# EAGLE design M207C (EAGLE 6.6.0)
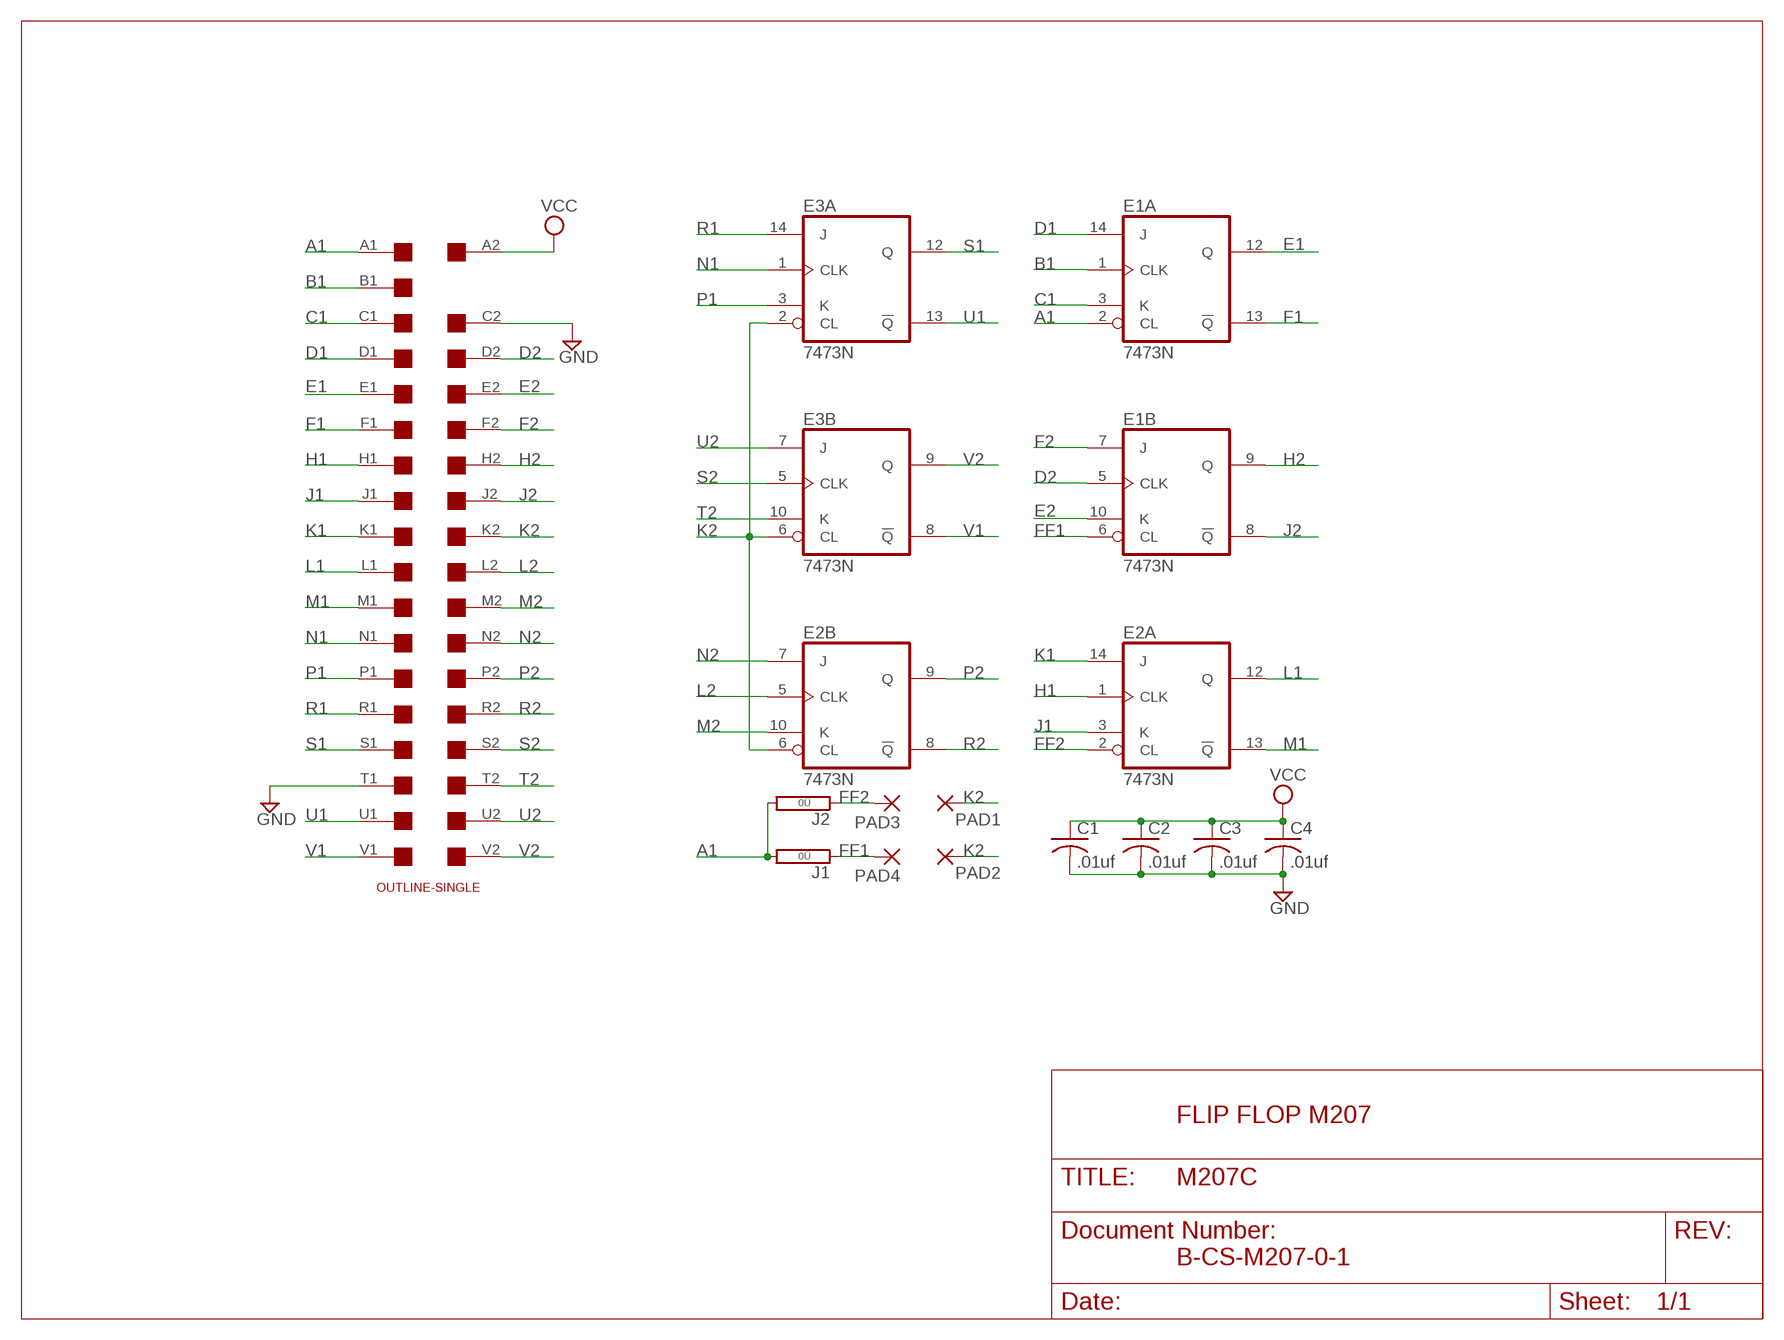
[diagram p0: schematic, sheet 1]

## Parts
C1  .01uf  C-US050-025X075  [C050-025X075]
C2  .01uf  C-US050-025X075  [C050-025X075]
C3  .01uf  C-US050-025X075  [C050-025X075]
C4  .01uf  C-US050-025X075  [C050-025X075]
E1  7473N  74LS73N  [DIL14]
E2  7473N  74LS73N  [DIL14]
E3  7473N  74LS73N  [DIL14]
J1  0R  [0R/10]
J2  0R  [0R/10]
PAD1  1,6/0,8  [1,6/0,8]
PAD2  1,6/0,8  [1,6/0,8]
PAD3  1,6/0,8  [1,6/0,8]
PAD4  1,6/0,8  [1,6/0,8]
U$1  SINGLE  [EDGE-CON2]
U$4  OUTLINE-SINGLE  [SINGLE]

## Nets
A1: E1.2(A:CL) J1.2 J2.2 U$1.A1
B1: E1.1(A:CLK) U$1.B1
C1: E1.3(A:K) U$1.C1
D1: E1.14(A:J) U$1.D1
D2: E1.5(B:CLK) U$1.D2
E1: E1.12(A:Q) U$1.E1
E2: E1.10(B:K) U$1.E2
F1: E1.13(A:!Q) U$1.F1
F2: E1.7(B:J) U$1.F2
FF1: E1.6(B:CL) J1.1 PAD4.1(P)
FF2: E2.2(A:CL) J2.1 PAD3.1(P)
GND [Supply]: C1.2 C2.2 C3.2 C4.2 U$1.C2 U$1.T1
H1: E2.1(A:CLK) U$1.H1
H2: E1.9(B:Q) U$1.H2
J1: E2.3(A:K) U$1.J1
J2: E1.8(B:!Q) U$1.J2
K1: E2.14(A:J) U$1.K1
K2: E2.6(B:CL) E3.2(A:CL) E3.6(B:CL) PAD1.1(P) PAD2.1(P) U$1.K2
L1: E2.12(A:Q) U$1.L1
L2: E2.5(B:CLK) U$1.L2
M1: E2.13(A:!Q) U$1.M1
M2: E2.10(B:K) U$1.M2
N1: E3.1(A:CLK) U$1.N1
N2: E2.7(B:J) U$1.N2
P1: E3.3(A:K) U$1.P1
P2: E2.9(B:Q) U$1.P2
R1: E3.14(A:J) U$1.R1
R2: E2.8(B:!Q) U$1.R2
S1: E3.12(A:Q) U$1.S1
S2: E3.5(B:CLK) U$1.S2
T2: E3.10(B:K) U$1.T2
U1: E3.13(A:!Q) U$1.U1
U2: E3.7(B:J) U$1.U2
V1: E3.8(B:!Q) U$1.V1
V2: E3.9(B:Q) U$1.V2
VCC [Supply]: C1.1 C2.1 C3.1 C4.1 U$1.A2
Unconnected: U$1.B2

## Notes on the sheet
- FLIP FLOP M207
- B-CS-M207-0-1

## Power pins joined to a net without a drawn wire
GND: E1.11(P:GND) E2.11(P:GND) E3.11(P:GND)
VCC: E1.4(P:VCC) E2.4(P:VCC) E3.4(P:VCC)

## Library data of the parts
C1-C4 = rcl:C-US: CAPACITOR, American symbol
E1-E3 = 74xx-us:74*73: Dual J-K FLIP FLOP, clear
J1 J2 = jumper:0R: Bridge 0R 10mm
PAD1-PAD4 = wirepad:1,6/0,8: THROUGH-HOLE PAD
U$1 = dec-con:SINGLE: Single-Height DEC board
U$4 = dec-con:OUTLINE-*: Board outlines for DEC boards.

## Net classes
1 Supply: width 0.813 mm

## Board
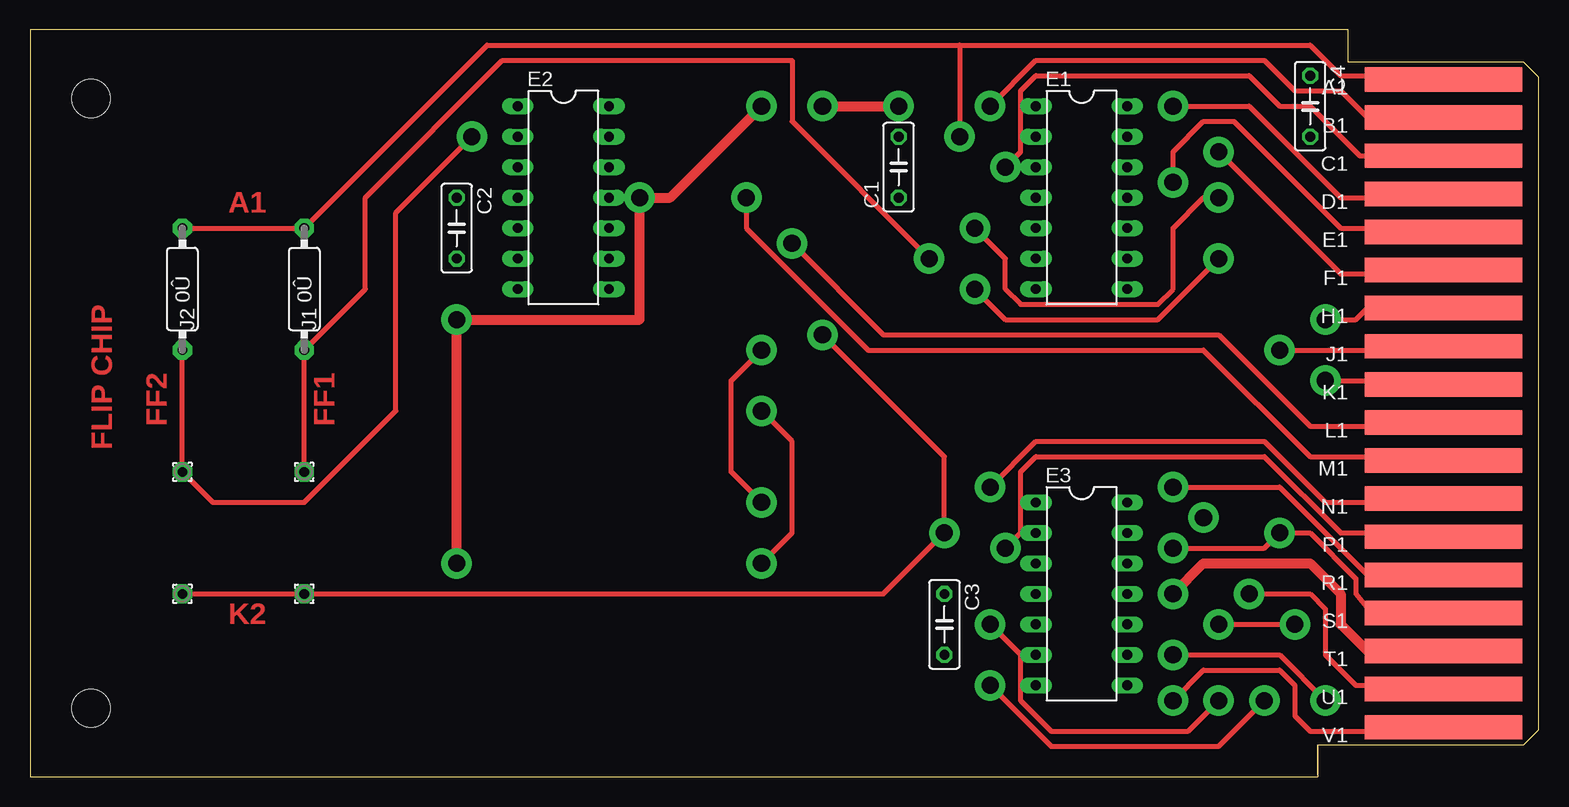
[diagram p1: board, top side]
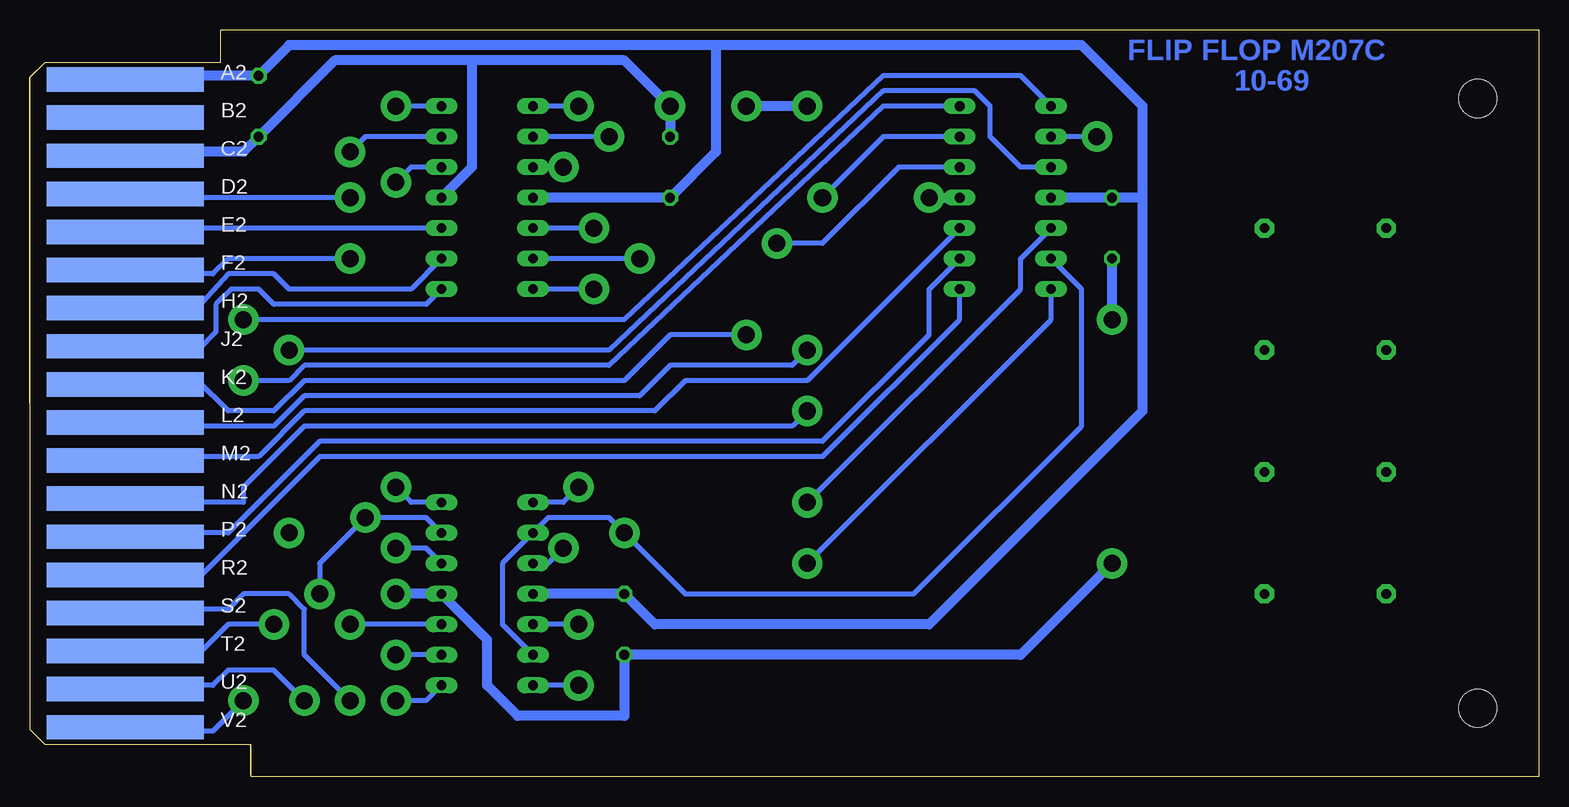
[diagram p2: board, bottom side, seen from below]

Size 125.73 x 62.23 mm. Coordinates in mm from the lower left corner, seen from the top.
Copper layers (1+16): Top 0.035mm / dielectric 1.5mm / Bottom 0.035mm
Design rules "16mils": minimum track width 16mil, minimum drill 32mil, track to track 15mil, track to pad 10mil, pad to pad 10mil, via to via 10mil, smd to smd 10mil, copper to edge 13mil, drill to drill 10mil, minimum pad ring 10mil, minimum via ring 8mil, stop-mask expansion 0mil, vias tented up to drill 0mil, thermal gap 10mil

### Footprints (pad centres in the part's own frame; a part is rotated, then mirrored left to right if it is on the bottom)
C050-025X075 = drill 0.813 octagon: 1 -2.54,0; 2 2.54,0
DIL14 = drill 0.813 long: 1 -7.62,-3.81; 2 -5.08,-3.81; 3 -2.54,-3.81; 4 0,-3.81; 5 2.54,-3.81; 6 5.08,-3.81; 7 7.62,-3.81; 8 7.62,3.81; 9 5.08,3.81; 10 2.54,3.81; 11 0,3.81; 12 -2.54,3.81; 13 -5.08,3.81; 14 -7.62,3.81
0R/10 = drill 0.813 pad 1.6 octagon: 1 -5.08,0; 2 5.08,0
1,6/0,8 = drill 0.813 pad 1.6 octagon: 1 0,0
EDGE-CON2 = smd 13.106 x 2.032: A1 7.938,4.128; B1 7.938,7.303; C1 7.938,10.477; D1 7.938,13.652; E1 7.938,16.828; F1 7.938,20.003; H1 7.938,23.177; J1 7.938,26.352; K1 7.938,29.527; L1 7.938,32.703; M1 7.938,35.877; N1 7.938,39.053; P1 7.938,42.227; R1 7.938,45.403; S1 7.938,48.578; T1 7.938,51.752; U1 7.938,54.928; V1 7.938,58.102 | smd 13.106 x 2.032 bottom: A2 7.938,4.128; B2 7.938,7.303; C2 7.938,10.477; D2 7.938,13.652; E2 7.938,16.828; F2 7.938,20.003; H2 7.938,23.177; J2 7.938,26.352; K2 7.938,29.527; L2 7.938,32.703; M2 7.938,35.877; N2 7.938,39.053; P2 7.938,42.227; R2 7.938,45.403; S2 7.938,48.578; T2 7.938,51.752; U2 7.938,54.928; V2 7.938,58.102
SINGLE = hole 3.175: 120.65,56.515; 120.65,5.715

### Placement (x,y rotation side)
C1  72.39,50.8 90 top
C2  35.56,45.72 270 top
C3  76.2,12.7 270 top
C4  106.68,55.88 270 top
E1  87.63,48.26 270 top
E2  44.45,48.26 270 top
E3  87.63,15.24 270 top
J1  22.86,40.64 90 top
J2  12.7,40.64 90 top
PAD1  12.7,15.24 270 top
PAD2  22.86,15.24 270 top
PAD3  12.7,25.4 270 top
PAD4  22.86,25.4 270 top
U$1  125.73,62.23 180 top
U$4  125.73,62.23 180 top

### Tracks (layer width: path | path; a pad name or v marks a point on that pad's centre or on a via)
A1  (via drill 1.42 pad 2.54)
  Top 0.406: J1.2 J2.2 J1.2 | U$1.A1 112.16,58.02 111.76,58.42 109.22,58.42 106.68,60.96 77.47,60.96 | 77.47,60.96 v77.47,53.34 | J1.2 38.1,60.96 77.47,60.96
  Bottom 0.406: v77.47,53.34 E1.2
B1  (via drill 1.42 pad 2.54)
  Top 0.406: U$1.B1 112.05,54.9 111.76,54.61 109.22,57.15 105.41,57.15 102.87,59.69 83.82,59.69 v80.01,55.88
  Bottom 0.406: v80.01,55.88 E1.1
C1  (via drill 1.42 pad 2.54)
  Top 0.406: U$1.C1 110.82,51.74 106.68,55.88 104.14,55.88 101.6,58.42 83.82,58.42 82.55,57.15 82.55,52.07 v81.28,50.8
  Bottom 0.406: v81.28,50.8 E1.3
D1  (via drill 1.42 pad 2.54)
  Top 0.406: U$1.D1 112.06,48.56 111.76,48.26 109.22,48.26 101.6,55.88 v95.25,55.88
  Bottom 0.406: E1.14 v95.25,55.88
D2  (via drill 1.42 pad 2.54)
  Top 0.406: v99.06,48.26 97.79,48.26 95.25,45.72 95.25,40.64 93.98,39.37 82.55,39.37 81.28,40.64 81.28,43.18 v78.74,45.72
  Bottom 0.406: v78.74,45.72 E1.5 | U$1.D2 112.06,48.56 111.76,48.26 v99.06,48.26
E1  (via drill 1.42 pad 2.54)
  Top 0.406: v95.25,49.53 95.25,52.07 97.79,54.61 100.33,54.61 109.22,45.72 111.76,45.72 112.09,45.39 U$1.E1
  Bottom 0.406: E1.12 93.98,50.8 v95.25,49.53
E2
  Bottom 0.406: U$1.E2 112.09,45.39 111.76,45.72 E1.10
F1  (via drill 1.42 pad 2.54)
  Top 0.406: v99.06,52.07 109.22,41.91 111.76,41.91 112.04,42.19 U$1.F1
  Bottom 0.406: E1.13 97.79,53.34 v99.06,52.07
F2  (via drill 1.42 pad 2.54)
  Top 0.406: v99.06,43.18 93.98,38.1 81.28,38.1 v78.74,40.64
  Bottom 0.406: v78.74,40.64 E1.7 | U$1.F2 112.04,42.19 111.76,41.91 110.49,41.91 109.22,43.18 v99.06,43.18
FF1  (via drill 1.42 pad 2.54)
  Top 0.406: PAD4.1 J1.1 27.94,40.64 27.94,48.26 39.37,59.69 63.5,59.69 63.5,54.61 v74.93,43.18
  Bottom 0.406: v74.93,43.18 E1.6
FF2  (via drill 1.42 pad 2.54)
  Top 0.406: J2.1 PAD3.1 15.24,22.86 22.86,22.86 30.48,30.48 30.48,46.99 v36.83,53.34
  Bottom 0.406: v36.83,53.34 E2.2
GND  (via drill 1.42 pad 2.54)
  Top 0.813: U$1.T1 112.09,10.49 111.76,10.16 109.22,12.7 109.22,15.24 106.68,17.78 97.79,17.78 v95.25,15.24 | v66.04,55.88 v72.39,55.88 | v60.96,55.88 53.34,48.26 v50.8,48.26 50.8,38.1 v35.56,38.1 v35.56,17.78
  Bottom 0.813: v95.25,15.24 E3.11 87.63,11.43 87.63,7.62 85.09,5.08 76.2,5.08 C3.2 43.18,10.16 v35.56,17.78 | C1.2 v72.39,55.88 76.2,59.69 88.9,59.69 | v60.96,55.88 v66.04,55.88 | v50.8,48.26 E2.11 | U$1.C2 112.09,51.74 111.76,52.07 107.95,52.07 C4.2 100.33,59.69 88.9,59.69 | v35.56,38.1 C2.2 | E1.11 88.9,50.8 88.9,59.69
H1  (via drill 1.42 pad 2.54)
  Top 0.406: U$1.H1 117.76,39.37 111.76,39.37 110.49,38.1 v107.95,38.1
  Bottom 0.406: E2.1 43.18,58.42 54.61,58.42 76.2,38.1 v107.95,38.1
H2
  Bottom 0.406: U$1.H2 111.84,39.04 109.22,41.91 105.41,41.91 104.14,40.64 93.98,40.64 E1.9
J1  (via drill 1.42 pad 2.54)
  Top 0.406: U$1.J1 117.76,35.56 v104.14,35.56
  Bottom 0.406: E2.3 43.18,50.8 45.72,53.34 45.72,55.88 46.99,57.15 54.61,57.15 77.47,35.56 v104.14,35.56
J2
  Bottom 0.406: U$1.J2 112.09,35.89 111.76,35.56 110.24,37.08 110.24,39.37 108.97,40.64 106.68,40.64 105.41,39.37 92.71,39.37 E1.8
K1  (via drill 1.42 pad 2.54)
  Top 0.406: U$1.K1 117.78,33.02 v107.95,33.02
  Bottom 0.406: E2.14 54.61,55.88 77.47,34.29 102.87,34.29 104.14,33.02 v107.95,33.02
K2  (via drill 1.42 pad 2.54)
  Top 0.406: PAD1.1 PAD2.1 71.12,15.24 v76.2,20.32 76.2,26.67 v66.04,36.83
  Bottom 0.406: E3.6 86.36,12.7 86.36,17.78 E3.2 82.55,21.59 77.47,21.59 v76.2,20.32 71.12,15.24 52.07,15.24 38.1,29.21 38.1,40.64 E2.6 | U$1.K2 112.06,32.72 111.76,33.02 109.22,30.48 105.41,30.48 102.87,33.02 76.2,33.02 72.39,36.83 v66.04,36.83
L1  (via drill 1.42 pad 2.54)
  Top 0.406: U$1.L1 112.09,29.54 111.76,29.21 106.68,29.21 99.06,36.83 71.12,36.83 v63.5,44.45
  Bottom 0.406: E2.12 53.34,50.8 59.69,44.45 v63.5,44.45
L2  (via drill 1.42 pad 2.54)
  Top 0.406: v60.96,22.86 58.42,25.4 58.42,33.02 v60.96,35.56
  Bottom 0.406: E2.5 43.18,43.18 43.18,40.64 v60.96,22.86 | U$1.L2 112.09,29.54 111.76,29.21 105.41,29.21 102.87,31.75 74.93,31.75 72.39,34.29 62.23,34.29 v60.96,35.56
M1  (via drill 1.42 pad 2.54)
  Top 0.406: U$1.M1 112.09,26.34 111.76,26.67 106.68,26.67 97.79,35.56 69.85,35.56 59.69,45.72 v59.69,48.26
  Bottom 0.406: E2.13 54.61,53.34 v59.69,48.26
M2
  Bottom 0.406: E2.10 60.96,33.02 71.12,33.02 73.66,30.48 102.87,30.48 106.68,26.67 111.76,26.67 112.09,26.34 U$1.M2
N1  (via drill 1.42 pad 2.54)
  Top 0.406: U$1.N1 112.09,23.19 111.76,22.86 107.95,22.86 102.87,27.94 83.82,27.94 v80.01,24.13
  Bottom 0.406: E3.1 81.28,22.86 v80.01,24.13
N2  (via drill 1.42 pad 2.54)
  Top 0.406: v60.96,17.78 63.5,20.32 63.5,27.94 v60.96,30.48
  Bottom 0.406: E2.7 40.64,38.1 v60.96,17.78 | U$1.N2 112.09,23.19 111.76,22.86 107.95,22.86 107.95,24.13 102.87,29.21 62.23,29.21 v60.96,30.48
P1  (via drill 1.42 pad 2.54)
  Top 0.406: U$1.P1 112.09,19.99 111.76,20.32 109.22,20.32 102.87,26.67 83.82,26.67 82.55,25.4 82.55,20.32 v81.28,19.05
  Bottom 0.406: E3.3 82.55,17.78 v81.28,19.05
P2
  Bottom 0.406: E2.9 50.8,40.64 50.8,36.83 59.69,27.94 101.6,27.94 109.22,20.32 111.76,20.32 U$1.P2
R1  (via drill 1.42 pad 2.54)
  Top 0.406: U$1.R1 117.76,16.51 111.76,16.51 104.14,24.13 v95.25,24.13
  Bottom 0.406: v95.25,24.13 93.98,22.86 E3.14
R2
  Bottom 0.406: E2.8 48.26,38.1 59.69,26.67 101.6,26.67 111.76,16.51 112.09,16.84 U$1.R2
S1  (via drill 1.42 pad 2.54)
  Top 0.406: v95.25,19.05 102.87,19.05 v104.14,20.32 106.68,20.32 110.49,16.51 110.49,15.24 111.51,13.97 117.78,13.97 U$1.S1
  Bottom 0.406: E3.12 92.71,19.05 v95.25,19.05
S2  (via drill 1.42 pad 2.54)
  Top 0.406: v99.06,6.35 96.52,3.81 85.09,3.81 82.55,6.35 82.55,10.16 v80.01,12.7
  Bottom 0.406: U$1.S2 117.78,13.97 109.22,13.97 107.95,15.24 104.14,15.24 102.87,13.97 102.87,10.16 v99.06,6.35 | v80.01,12.7 E3.5
T2  (via drill 1.42 pad 2.54)
  Top 0.406: v99.06,12.7 v105.41,12.7
  Bottom 0.406: U$1.T2 117.76,10.16 111.76,10.16 109.22,12.7 v105.41,12.7 | E3.10 v99.06,12.7
U1  (via drill 1.42 pad 2.54)
  Top 0.406: U$1.U1 117.73,7.62 110.49,7.62 107.95,10.16 107.95,13.97 106.68,15.24 v101.6,15.24
  Bottom 0.406: E3.13 92.71,21.59 v97.79,21.59 101.6,17.78 v101.6,15.24
U2  (via drill 1.42 pad 2.54)
  Top 0.406: v102.87,6.35 99.06,2.54 85.09,2.54 v80.01,7.62
  Bottom 0.406: U$1.U2 117.73,7.62 110.49,7.62 109.22,8.89 105.41,8.89 v102.87,6.35 | v80.01,7.62 E3.7
V1  (via drill 1.42 pad 2.54)
  Top 0.406: U$1.V1 112.15,4.2 111.76,3.81 106.68,3.81 105.41,5.08 105.41,7.62 104.14,8.89 97.79,8.89 v95.25,6.35
  Bottom 0.406: v95.25,6.35 92.71,6.35 E3.8
V2  (via drill 1.42 pad 2.54)
  Top 0.406: v95.25,10.16 104.14,10.16 v107.95,6.35
  Bottom 0.406: U$1.V2 112.15,4.2 111.76,3.81 110.49,3.81 v107.95,6.35 | E3.9 v95.25,10.16
VCC
  Bottom 0.813: E3.4 C3.1 73.66,12.7 50.8,12.7 33.02,30.48 33.02,48.26 | E1.4 C1.1 68.58,52.07 68.58,60.96 | U$1.A2 112.16,58.02 111.76,58.42 C4.1 104.14,60.96 68.58,60.96 | 33.02,48.26 C2.1 E2.4 | 33.02,48.26 33.02,55.88 38.1,60.96 68.58,60.96

### Text on the board
Top: A1 | FLIP CHIP | FF2 | FF1 | K2
Bottom: FLIP FLOP M207C | 10-69